# Altium schematic sheet FPGA_MCU_Control_Top.SchDoc: FPGA_MCU_Top
size A; Author: Michael Jones; Engineer: Michael Jones; Organization: Group VIII Technology; Address1: 1652 W 820 N; Address2: Provo; Address3: UT  84601; Address4: 801-379-0118; DocumentNumber: 1; Revision: A3; SheetNumber: 1; SheetTotal: 6
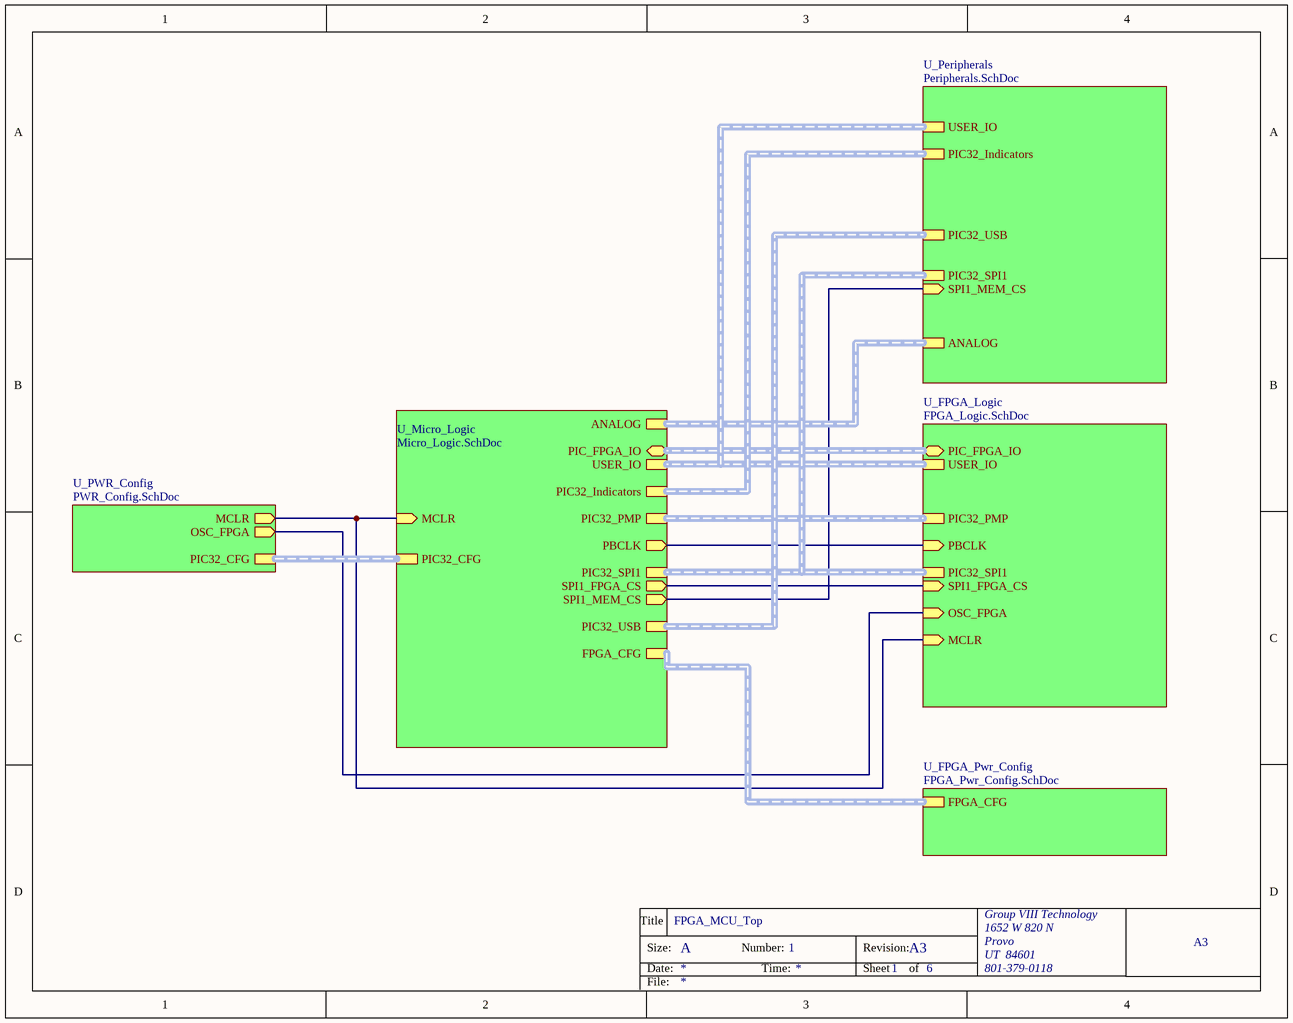
[diagram p0: FPGA_MCU_Control_Top.SchDoc]

## Sub-sheets
U_FPGA_Logic = FPGA_Logic.SchDoc: PBCLK (in), PIC32_PMP (harness PIC32_PMP), MCLR (in), USER_IO (harness USER_IO), PIC32_SPI1 (harness SPI1), SPI1_FPGA_CS (in), OSC_FPGA (in), PIC_FPGA_IO (harness PIC_FPGA_IO)
U_FPGA_Pwr_Config = FPGA_Pwr_Config.SchDoc: FPGA_CFG (harness Harness)
U_Micro_Logic = Micro_Logic.SchDoc: PIC32_PMP (harness PIC32_PMP), PIC32_Indicators (harness Indicators), PIC32_SPI1 (harness SPI1), PIC32_USB (harness USB), PIC32_CFG (harness PIC32_CFG), FPGA_CFG (harness FPGA CFG), USER_IO (harness USER_IO), SPI1_MEM_CS (out), SPI1_FPGA_CS (out), ANALOG (harness ANALOG), PBCLK (out), PIC_FPGA_IO (harness PIC_FPGA_IO), MCLR (in)
U_Peripherals = Peripherals.SchDoc: PIC32_Indicators (harness Indicators), PIC32_USB (harness USB), PIC32_SPI1 (harness SPI1), USER_IO (harness USER_IO), SPI1_MEM_CS (in), ANALOG (harness ANALOG)
U_PWR_Config = PWR_Config.SchDoc: PIC32_CFG (harness PIC32_CFG), OSC_FPGA (out), MCLR (out)

## Nets
(unnamed): sheet U_FPGA_Logic/PBCLK, sheet U_Micro_Logic/PBCLK
(unnamed): sheet U_FPGA_Logic/MCLR, sheet U_Micro_Logic/MCLR, sheet U_PWR_Config/MCLR
(unnamed): sheet U_FPGA_Logic/SPI1_FPGA_CS, sheet U_Micro_Logic/SPI1_FPGA_CS
(unnamed): sheet U_FPGA_Logic/OSC_FPGA, sheet U_PWR_Config/OSC_FPGA
(unnamed): sheet U_Micro_Logic/SPI1_MEM_CS, sheet U_Peripherals/SPI1_MEM_CS

## Buses and harness runs
harness sheet U_FPGA_Logic/PIC32_PMP = sheet U_Micro_Logic/PIC32_PMP
harness sheet U_FPGA_Logic/PIC32_SPI1 = sheet U_Micro_Logic/PIC32_SPI1 = sheet U_Peripherals/PIC32_SPI1
harness sheet U_FPGA_Logic/PIC_FPGA_IO = sheet U_Micro_Logic/PIC_FPGA_IO
harness sheet U_FPGA_Logic/USER_IO = sheet U_Micro_Logic/USER_IO = sheet U_Peripherals/USER_IO
harness sheet U_FPGA_Pwr_Config/FPGA_CFG = sheet U_Micro_Logic/FPGA_CFG
harness sheet U_Micro_Logic/ANALOG = sheet U_Peripherals/ANALOG
harness sheet U_Micro_Logic/PIC32_CFG = sheet U_PWR_Config/PIC32_CFG
harness sheet U_Micro_Logic/PIC32_Indicators = sheet U_Peripherals/PIC32_Indicators
harness sheet U_Micro_Logic/PIC32_USB = sheet U_Peripherals/PIC32_USB

## Notes on the sheet
- Title
- Size:
- Date:
- A
- Number:
- Time:
- Revision:
- Sheet
- of
- File: